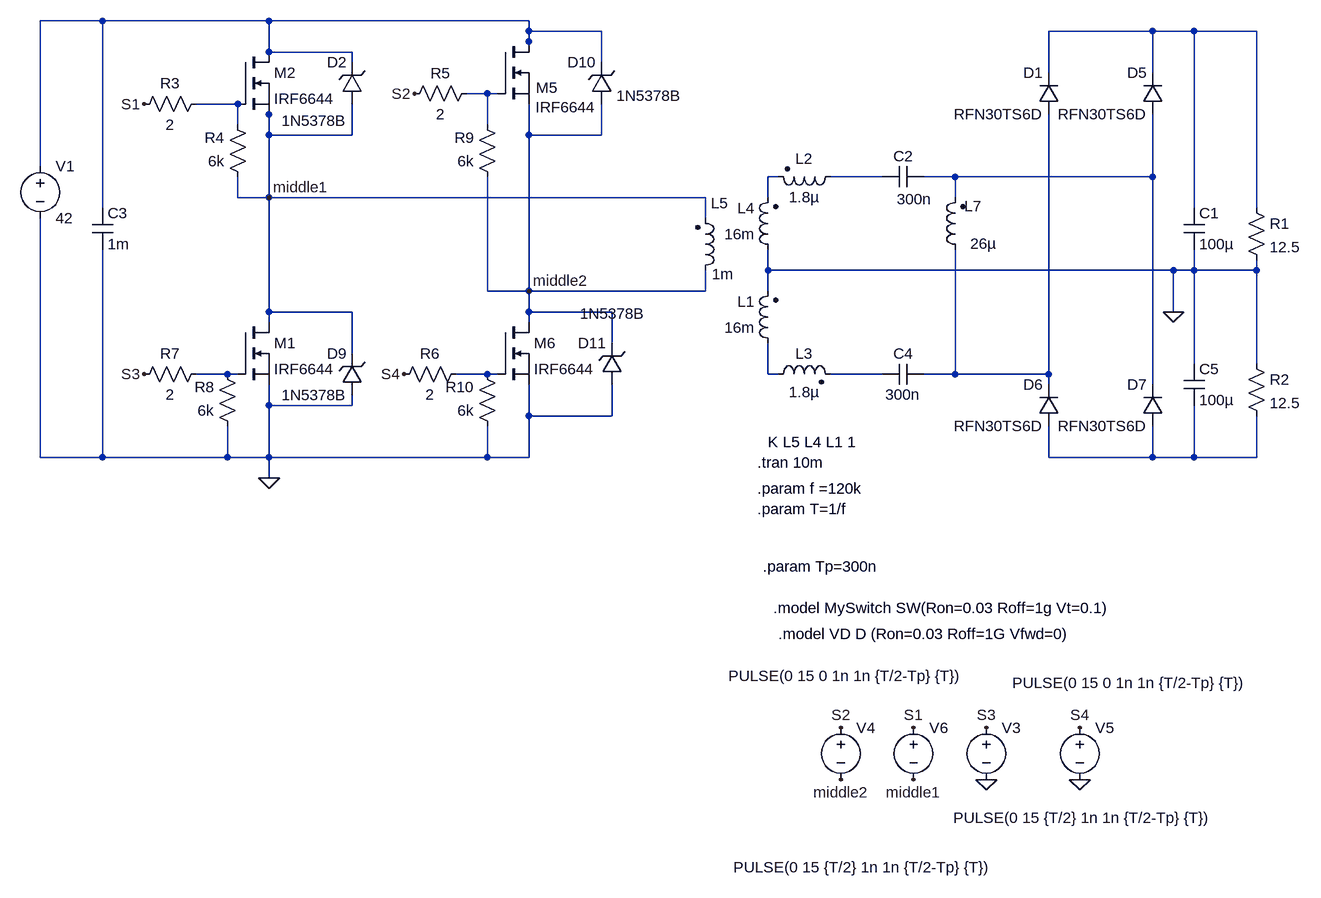
[diagram p0: schematic M.asc]
M.asc, the LTspice schematic file:
Version 4
SHEET 1 1012 1256
WIRE -1824 -64 -1920 -64
WIRE -1568 -64 -1824 -64
WIRE -1168 -64 -1568 -64
WIRE -1168 -48 -1168 -64
WIRE -1056 -48 -1168 -48
WIRE -208 -48 -368 -48
WIRE -144 -48 -208 -48
WIRE -48 -48 -144 -48
WIRE -1168 -32 -1168 -48
WIRE -1568 -16 -1568 -64
WIRE -1440 -16 -1568 -16
WIRE -1168 -16 -1168 -32
WIRE -1440 0 -1440 -16
WIRE -1056 0 -1056 -48
WIRE -368 16 -368 -48
WIRE -208 16 -208 -48
WIRE -1232 48 -1264 48
WIRE -1216 48 -1232 48
WIRE -1616 64 -1680 64
WIRE -1568 80 -1568 64
WIRE -1616 96 -1616 64
WIRE -1232 96 -1232 48
WIRE -1568 112 -1568 80
WIRE -1440 112 -1440 64
WIRE -1440 112 -1568 112
WIRE -1168 112 -1168 64
WIRE -1056 112 -1056 64
WIRE -1056 112 -1168 112
WIRE -1920 160 -1920 -64
WIRE -784 176 -800 176
WIRE -624 176 -704 176
WIRE -512 176 -560 176
WIRE -208 176 -208 80
WIRE -208 176 -512 176
WIRE -1616 208 -1616 176
WIRE -1568 208 -1568 112
WIRE -1568 208 -1616 208
WIRE -896 208 -1568 208
WIRE -800 208 -800 176
WIRE -512 208 -512 176
WIRE -1824 224 -1824 -64
WIRE -144 224 -144 -48
WIRE -48 224 -48 -48
WIRE -896 240 -896 208
WIRE -800 320 -800 288
WIRE -176 320 -800 320
WIRE -144 320 -144 288
WIRE -144 320 -176 320
WIRE -48 320 -48 304
WIRE -48 320 -144 320
WIRE -1232 352 -1232 176
WIRE -1168 352 -1168 112
WIRE -1168 352 -1232 352
WIRE -896 352 -896 320
WIRE -896 352 -1168 352
WIRE -800 352 -800 320
WIRE -1568 384 -1568 208
WIRE -1440 384 -1568 384
WIRE -1168 384 -1168 352
WIRE -1040 384 -1168 384
WIRE -176 384 -176 320
WIRE -1568 400 -1568 384
WIRE -1168 400 -1168 384
WIRE -1040 432 -1040 384
WIRE -1440 448 -1440 384
WIRE -144 464 -144 320
WIRE -48 464 -48 320
WIRE -1632 480 -1680 480
WIRE -1616 480 -1632 480
WIRE -1232 480 -1280 480
WIRE -1216 480 -1232 480
WIRE -800 480 -800 432
WIRE -784 480 -800 480
WIRE -624 480 -704 480
WIRE -512 480 -512 288
WIRE -512 480 -560 480
WIRE -368 480 -368 80
WIRE -368 480 -512 480
WIRE -368 496 -368 480
WIRE -208 496 -208 176
WIRE -1568 528 -1568 496
WIRE -1440 528 -1440 512
WIRE -1440 528 -1568 528
WIRE -1168 544 -1168 496
WIRE -1040 544 -1040 496
WIRE -1040 544 -1168 544
WIRE -1920 608 -1920 240
WIRE -1824 608 -1824 288
WIRE -1824 608 -1920 608
WIRE -1632 608 -1632 560
WIRE -1632 608 -1824 608
WIRE -1568 608 -1568 528
WIRE -1568 608 -1632 608
WIRE -1232 608 -1232 560
WIRE -1232 608 -1568 608
WIRE -1168 608 -1168 544
WIRE -1168 608 -1232 608
WIRE -368 608 -368 560
WIRE -208 608 -208 560
WIRE -208 608 -368 608
WIRE -144 608 -144 528
WIRE -144 608 -208 608
WIRE -48 608 -48 544
WIRE -48 608 -144 608
WIRE -1568 640 -1568 608
FLAG -1568 208 middle1
FLAG -576 1104 middle1
FLAG -688 1104 middle2
FLAG -1168 352 middle2
FLAG -1568 640 0
FLAG -320 1104 0
FLAG -464 1104 0
FLAG -576 1024 S1
FLAG -688 1024 S2
FLAG -1760 64 S1
FLAG -464 1024 S3
FLAG -320 1024 S4
FLAG -1360 480 S4
FLAG -1760 480 S3
FLAG -1344 48 S2
FLAG -176 384 0
SYMBOL diode -352 80 R180
WINDOW 0 24 64 Left 2
WINDOW 3 24 0 Left 2
SYMATTR InstName D1
SYMATTR Value RFN30TS6D
SYMBOL res -64 208 R0
SYMATTR InstName R1
SYMATTR Value 12.5
SYMBOL cap -160 224 R0
SYMATTR InstName C1
SYMATTR Value 100µ
SYMBOL cap -560 160 R90
WINDOW 0 0 32 VBottom 2
WINDOW 3 35 15 VTop 2
SYMATTR InstName C2
SYMATTR Value 300n
SYMBOL ind2 -784 304 R180
WINDOW 0 36 80 Left 2
WINDOW 3 36 40 Left 2
SYMATTR InstName L4
SYMATTR Value 16m
SYMATTR Type ind
SYMBOL ind2 -912 336 M180
WINDOW 0 24 119 Left 2
WINDOW 3 26 10 Left 2
SYMATTR InstName L5
SYMATTR Value 1m
SYMATTR Type ind
SYMBOL voltage -1920 144 R0
WINDOW 123 0 0 Left 0
WINDOW 39 0 0 Left 0
SYMATTR InstName V1
SYMATTR Value 42
SYMBOL voltage -464 1008 R0
WINDOW 3 40 -53 Left 2
WINDOW 123 0 0 Left 0
WINDOW 39 0 0 Left 0
SYMATTR Value PULSE(0 15 0 1n 1n {T/2-Tp} {T})
SYMATTR InstName V3
SYMBOL voltage -320 1008 R0
WINDOW 123 0 0 Left 0
WINDOW 39 0 0 Left 0
WINDOW 3 -195 155 Left 2
SYMATTR Value PULSE(0 15 {T/2} 1n 1n {T/2-Tp} {T})
SYMATTR InstName V5
SYMBOL voltage -576 1008 R0
WINDOW 3 -277 231 Left 2
WINDOW 123 0 0 Left 0
WINDOW 39 0 0 Left 0
SYMATTR Value PULSE(0 15 {T/2} 1n 1n {T/2-Tp} {T})
SYMATTR InstName V6
SYMBOL voltage -688 1008 R0
WINDOW 123 0 0 Left 0
WINDOW 39 0 0 Left 0
WINDOW 3 -173 -64 Left 2
SYMATTR Value PULSE(0 15 0 1n 1n {T/2-Tp} {T})
SYMATTR InstName V4
SYMBOL diode -192 80 R180
WINDOW 0 24 64 Left 2
WINDOW 3 24 0 Left 2
SYMATTR InstName D5
SYMATTR Value RFN30TS6D
SYMBOL diode -352 560 R180
WINDOW 0 24 64 Left 2
WINDOW 3 24 0 Left 2
SYMATTR InstName D6
SYMATTR Value RFN30TS6D
SYMBOL diode -192 560 R180
WINDOW 0 24 64 Left 2
WINDOW 3 24 0 Left 2
SYMATTR InstName D7
SYMATTR Value RFN30TS6D
SYMBOL nmos -1616 -16 R0
SYMATTR InstName M2
SYMATTR Value IRF6644
SYMBOL res -1664 48 R90
WINDOW 0 0 56 VBottom 2
WINDOW 3 32 56 VTop 2
SYMATTR InstName R3
SYMATTR Value 2
SYMBOL res -1600 192 R180
WINDOW 0 36 76 Left 2
WINDOW 3 36 40 Left 2
SYMATTR InstName R4
SYMATTR Value 6k
SYMBOL res -1248 32 R90
WINDOW 0 0 56 VBottom 2
WINDOW 3 32 56 VTop 2
SYMATTR InstName R5
SYMATTR Value 2
SYMBOL res -1264 464 R90
WINDOW 0 0 56 VBottom 2
WINDOW 3 32 56 VTop 2
SYMATTR InstName R6
SYMATTR Value 2
SYMBOL res -1664 464 R90
WINDOW 0 0 56 VBottom 2
WINDOW 3 32 56 VTop 2
SYMATTR InstName R7
SYMATTR Value 2
SYMBOL res -1616 576 R180
WINDOW 0 36 76 Left 2
WINDOW 3 36 40 Left 2
SYMATTR InstName R8
SYMATTR Value 6k
SYMBOL res -1216 192 R180
WINDOW 0 36 76 Left 2
WINDOW 3 36 40 Left 2
SYMATTR InstName R9
SYMATTR Value 6k
SYMBOL res -1216 576 R180
WINDOW 0 36 76 Left 2
WINDOW 3 36 40 Left 2
SYMATTR InstName R10
SYMATTR Value 6k
SYMBOL nmos -1216 -32 R0
WINDOW 0 59 71 Left 2
WINDOW 3 58 101 Left 2
SYMATTR InstName M5
SYMATTR Value IRF6644
SYMBOL nmos -1216 400 R0
SYMATTR InstName M6
SYMATTR Value IRF6644
SYMBOL nmos -1616 400 R0
SYMATTR InstName M1
SYMATTR Value IRF6644
SYMBOL zener -1424 64 R180
WINDOW 0 24 64 Left 2
WINDOW 3 24 -26 Left 2
SYMATTR InstName D2
SYMATTR Value 1N5378B
SYMATTR Description Diode
SYMATTR Type diode
SYMBOL cap -1840 224 R0
SYMATTR InstName C3
SYMATTR Value 1m
SYMBOL zener -1424 512 R180
WINDOW 0 24 64 Left 2
WINDOW 3 24 0 Left 2
SYMATTR InstName D9
SYMATTR Value 1N5378B
SYMATTR Description Diode
SYMATTR Type diode
SYMBOL zener -1040 64 R180
WINDOW 0 24 64 Left 2
WINDOW 3 -107 13 Left 2
SYMATTR InstName D10
SYMATTR Value 1N5378B
SYMATTR Description Diode
SYMATTR Type diode
SYMBOL zener -1024 496 R180
WINDOW 0 24 64 Left 2
WINDOW 3 -35 109 Left 2
SYMATTR InstName D11
SYMATTR Value 1N5378B
SYMATTR Description Diode
SYMATTR Type diode
SYMBOL ind2 -784 448 R180
WINDOW 0 36 80 Left 2
WINDOW 3 36 40 Left 2
SYMATTR InstName L1
SYMATTR Value 16m
SYMATTR Type ind
SYMBOL cap -560 464 R90
WINDOW 0 0 32 VBottom 2
WINDOW 3 32 32 VTop 2
SYMATTR InstName C4
SYMATTR Value 300n
SYMBOL res -64 448 R0
SYMATTR InstName R2
SYMATTR Value 12.5
SYMBOL cap -160 464 R0
SYMATTR InstName C5
SYMATTR Value 100µ
SYMBOL ind2 -496 304 R180
WINDOW 0 -25 83 Left 2
WINDOW 3 -48 25 Left 2
SYMATTR InstName L7
SYMATTR Value 26µ
SYMATTR Type ind
SYMBOL ind2 -688 160 R90
WINDOW 0 4 56 VBottom 2
WINDOW 3 32 56 VTop 2
SYMATTR InstName L2
SYMATTR Value 1.8µ
SYMATTR Type ind
SYMBOL ind2 -800 496 R270
WINDOW 0 32 56 VTop 2
WINDOW 3 4 56 VBottom 2
SYMATTR InstName L3
SYMATTR Value 1.8µ
SYMATTR Type ind
TEXT -816 616 Left 2 !.tran 10m
TEXT -800 584 Left 2 !K L5 L4 L1 1
TEXT -816 656 Left 2 !.param f =120k\n.param T=1/f
TEXT -808 776 Left 2 !.param Tp=300n
TEXT -792 840 Left 2 !.model MySwitch SW(Ron=0.03 Roff=1g Vt=0.1)
TEXT -784 880 Left 2 !.model VD D (Ron=0.03 Roff=1G Vfwd=0)

The netlist it stands for:
* M.asc
D1 N012 N002 RFN30TS6D
R1 N002 0 12.5
C1 N002 0 100µ
C2 N007 N006 300n
L4 0 N005 16m
L5 middle2 middle1 1m
V1 N001 0 42
V3 S3 0 PULSE(0 15 0 1n 1n {T/2-Tp} {T})
V5 S4 0 PULSE(0 15 {T/2} 1n 1n {T/2-Tp} {T})
V6 S1 middle1 PULSE(0 15 {T/2} 1n 1n {T/2-Tp} {T})
V4 S2 middle2 PULSE(0 15 0 1n 1n {T/2-Tp} {T})
D5 N007 N002 RFN30TS6D
D6 N013 N012 RFN30TS6D
D7 N013 N007 RFN30TS6D
M2 N001 N004 middle1 middle1 IRF6644
R3 N004 S1 2
R4 middle1 N004 6k
R5 N003 S2 2
R6 N009 S4 2
R7 N008 S3 2
R8 0 N008 6k
R9 middle2 N003 6k
R10 0 N009 6k
M5 N001 N003 middle2 middle2 IRF6644
M6 middle2 N009 0 0 IRF6644
M1 middle1 N008 0 0 IRF6644
D2 middle1 N001 1N5378B
C3 N001 0 1m
D9 0 middle1 1N5378B
D10 middle2 N001 1N5378B
D11 0 middle2 1N5378B
L1 N010 0 16m
C4 N012 N011 300n
R2 0 N013 12.5
C5 0 N013 100µ
L7 N012 N007 26µ
L2 N006 N005 1.8µ
L3 N010 N011 1.8µ
.model D D
.lib standard.dio
.model NMOS NMOS
.model PMOS PMOS
.lib standard.mos
.tran 10m
K L5 L4 L1 1
.param f =120k
.param T=1/f
.param Tp=300n
.model MySwitch SW(Ron=0.03 Roff=1g Vt=0.1)
.model VD D (Ron=0.03 Roff=1G Vfwd=0)
.backanno
.end